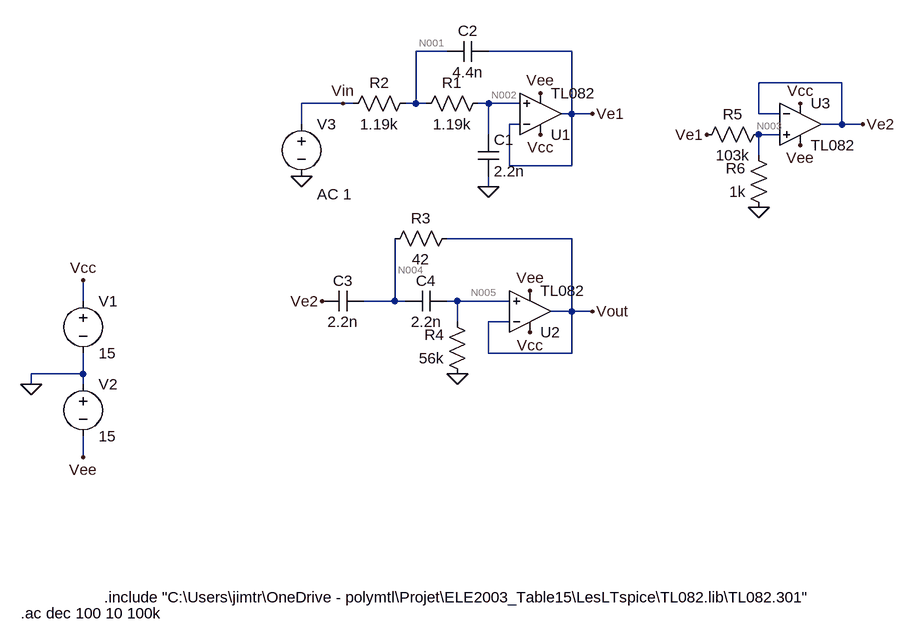
[diagram p0: schematic MonCircuit_passe-bande.asc]
MonCircuit_passe-bande.asc, the LTspice schematic file:
Version 4.1
SHEET 1 1676 680
WIRE 592 -304 544 -304
WIRE 784 -304 656 -304
WIRE 1200 -256 1072 -256
WIRE 432 -224 368 -224
WIRE 448 -224 432 -224
WIRE 544 -224 544 -304
WIRE 544 -224 528 -224
WIRE 560 -224 544 -224
WIRE 656 -224 640 -224
WIRE 704 -224 656 -224
WIRE 784 -208 784 -304
WIRE 784 -208 768 -208
WIRE 816 -208 784 -208
WIRE 1072 -208 1072 -256
WIRE 1104 -208 1072 -208
WIRE 368 -192 368 -224
WIRE 704 -192 688 -192
WIRE 1200 -192 1200 -256
WIRE 1200 -192 1168 -192
WIRE 1232 -192 1200 -192
WIRE 656 -176 656 -224
WIRE 1104 -176 1072 -176
WIRE 1072 -144 1072 -176
WIRE 688 -128 688 -192
WIRE 784 -128 784 -208
WIRE 784 -128 688 -128
WIRE 656 -96 656 -112
WIRE 784 -16 592 -16
WIRE 32 80 32 48
WIRE 512 80 512 -16
WIRE 512 80 464 80
WIRE 528 80 512 80
WIRE 608 80 592 80
WIRE 688 80 608 80
WIRE 784 96 784 -16
WIRE 784 96 752 96
WIRE 816 96 784 96
WIRE 608 112 608 80
WIRE 688 112 656 112
WIRE 656 160 656 112
WIRE 784 160 784 96
WIRE 784 160 656 160
WIRE 32 192 32 160
WIRE 32 192 -48 192
WIRE -48 208 -48 192
WIRE 32 208 32 192
WIRE 32 320 32 288
FLAG -48 208 0
FLAG 32 48 Vcc
FLAG 32 320 Vee
FLAG 736 -176 Vcc
FLAG 736 -240 Vee
FLAG 656 -96 0
FLAG 432 -224 Vin
FLAG 368 -112 0
FLAG 608 192 0
FLAG 720 128 Vcc
FLAG 720 64 Vee
FLAG 816 -208 Ve1
FLAG 816 96 Vout
FLAG 1232 -192 Ve2
FLAG 1136 -224 Vcc
FLAG 1136 -160 Vee
FLAG 1072 -64 0
FLAG 992 -176 Ve1
FLAG 400 80 Ve2
SYMBOL voltage 32 64 R0
WINDOW 123 0 0 Left 0
WINDOW 39 0 0 Left 0
SYMATTR InstName V1
SYMATTR Value 15
SYMBOL voltage 32 192 R0
WINDOW 123 0 0 Left 0
WINDOW 39 0 0 Left 0
SYMATTR InstName V2
SYMATTR Value 15
SYMBOL OpAmps\\opamp2 736 -144 M180
SYMATTR InstName U1
SYMATTR Value TL082
SYMBOL cap 640 -176 R0
SYMATTR InstName C1
SYMATTR Value 2.2n
SYMBOL res 656 -240 R90
WINDOW 0 0 56 VBottom 2
WINDOW 3 32 56 VTop 2
SYMATTR InstName R1
SYMATTR Value 1.19k
SYMBOL res 544 -240 R90
WINDOW 0 0 56 VBottom 2
WINDOW 3 32 56 VTop 2
SYMATTR InstName R2
SYMATTR Value 1.19k
SYMBOL cap 656 -320 R90
WINDOW 0 0 32 VBottom 2
WINDOW 3 32 32 VTop 2
SYMATTR InstName C2
SYMATTR Value 4.4n
SYMBOL voltage 368 -208 R0
WINDOW 123 24 124 Left 2
WINDOW 39 0 0 Left 0
SYMATTR InstName V3
SYMATTR Value ""
SYMATTR Value2 AC 1
SYMBOL cap 464 64 R90
WINDOW 0 0 32 VBottom 2
WINDOW 3 32 32 VTop 2
SYMATTR InstName C3
SYMATTR Value 2.2n
SYMBOL cap 592 64 R90
WINDOW 0 0 32 VBottom 2
WINDOW 3 32 32 VTop 2
SYMATTR InstName C4
SYMATTR Value 2.2n
SYMBOL res 608 -32 R90
WINDOW 0 0 56 VBottom 2
WINDOW 3 32 56 VTop 2
SYMATTR InstName R3
SYMATTR Value 42
SYMBOL res 624 208 R180
WINDOW 0 36 76 Left 2
WINDOW 3 36 40 Left 2
SYMATTR InstName R4
SYMATTR Value 56k
SYMBOL OpAmps\\opamp2 720 160 M180
SYMATTR InstName U2
SYMATTR Value TL082
SYMBOL OpAmps\\opamp2 1136 -256 R0
SYMATTR InstName U3
SYMATTR Value TL082
SYMBOL res 1088 -192 R90
WINDOW 0 0 56 VBottom 2
WINDOW 3 32 56 VTop 2
SYMATTR InstName R5
SYMATTR Value 103k
SYMBOL res 1088 -48 R180
WINDOW 0 36 76 Left 2
WINDOW 3 36 40 Left 2
SYMATTR InstName R6
SYMATTR Value 1k
TEXT 64 536 Left 2 !.include "C:\\Users\\jimtr\\OneDrive - polymtl\\Projet\\ELE2003_Table15\\LesLTspice\\TL082.lib\\TL082.301"
TEXT -64 560 Left 2 !.ac dec 100 10 100k

The netlist it stands for:
* MonCircuit_passe-bande.asc
V1 Vcc 0 15
V2 0 Vee 15
X§U1 N002 Ve1 Vcc Vee Ve1 TL082  ; pins In+ In- V+ V- OUT
C1 N002 0 2.2n
R1 N002 N001 1.19k
R2 N001 Vin 1.19k
C2 Ve1 N001 4.4n
V3 Vin 0 AC 1
C3 N004 Ve2 2.2n
C4 N005 N004 2.2n
R3 Vout N004 42
R4 0 N005 56k
X§U2 N005 Vout Vcc Vee Vout TL082  ; pins In+ In- V+ V- OUT
X§U3 N003 Ve2 Vcc Vee Ve2 TL082  ; pins In+ In- V+ V- OUT
R5 N003 Ve1 103k
R6 0 N003 1k
.include "C:\Users\jimtr\OneDrive - polymtl\Projet\ELE2003_Table15\LesLTspice\TL082.lib\TL082.301"
.ac dec 100 10 100k
.backanno
.end

* Results of the author's LTspice run, read from the files saved beside the schematic
* Operating Point, zero values left out:
*   V(vee) = -15 V
*   V(ve1) = 10.86 µV
*   V(n001) = -53.61 nV
*   V(n004) = 8.448 µV
*   V(vout) = 8.448 µV
*   V(vcc) = 15 V
*   V(n002) = -107.2 nV
*   V(ve2) = 11.03 µV
*   V(n005) = -2.523 µV
*   V(n003) = 59.84 nV
*   I(V1) = -42.58 mA
*   I(R4) = 45.05 pA
*   I(R6) = -59.84 pA
*   I(R1) = -45.05 pA
*   I(V3) = -45.05 pA
*   I(R2) = -45.05 pA
*   I(R5) = -104.9 pA
*   I(V2) = -42.58 mA
*   Ix(u2:1) = 45.05 pA
*   Ix(u2:2) = 45.05 pA
*   Ix(u2:3) = 14.19 mA
*   Ix(u2:4) = -14.19 mA
*   Ix(u2:5) = -45.05 pA
*   Ix(u1:1) = 45.05 pA
*   Ix(u1:2) = 45.05 pA
*   Ix(u1:3) = 14.19 mA
*   Ix(u1:4) = -14.19 mA
*   Ix(u1:5) = -149.9 pA
*   Ix(u3:1) = 45.05 pA
*   Ix(u3:2) = 45.05 pA
*   Ix(u3:3) = 14.19 mA
*   Ix(u3:4) = -14.19 mA
*   Ix(u3:5) = -45.05 pA
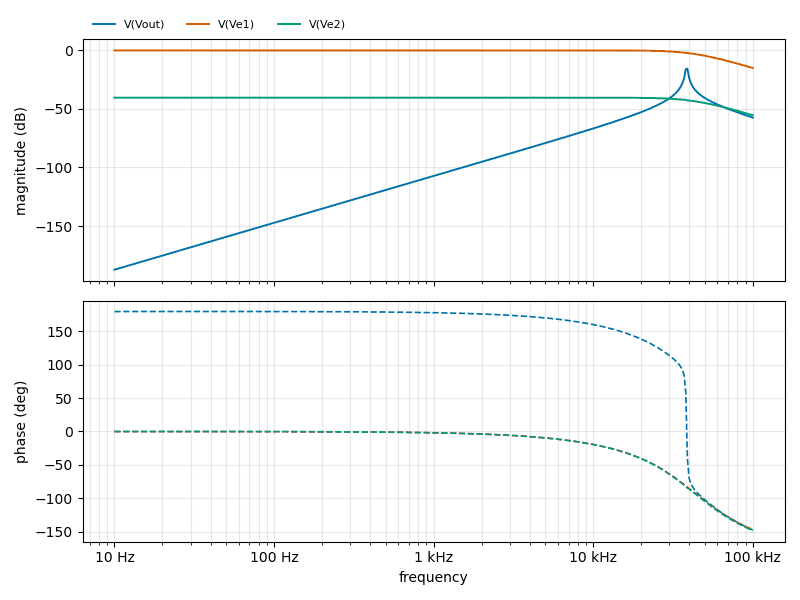
[diagram p1: AC Analysis of MonCircuit_passe-bande.asc, plotted from the saved traces]
* AC Analysis, 1 run:
*   V(Vout): -187.28 dB at 10 Hz, -57.47 dB at 100 kHz, peak -15.60 dB at 38.9 kHz, 3 dB below the peak at 37.72 kHz and 39.27 kHz
*   V(Ve1): -0.00 dB at 10 Hz, -15.01 dB at 100 kHz, peak 0.00 dB at 5.623 kHz, 3 dB below the peak at 42.97 kHz
*   V(Ve2): -40.34 dB at 10 Hz, -55.34 dB at 100 kHz, peak -40.34 dB at 5.754 kHz, 3 dB below the peak at 42.85 kHz